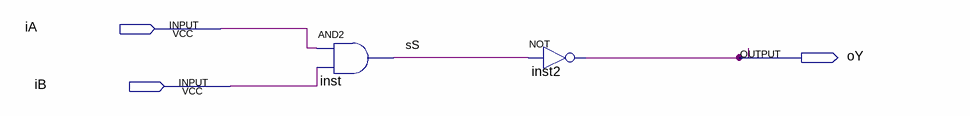
[diagram p0: schematic sheet]
// Quartus schematic MyFirstDigitalSystem.bdf as structural Verilog: 2 symbols, 3 pins
module MyFirstDigitalSystem (
  input  iA,
  input  iB,
  output oY
);

  wire sS;

  and inst (sS, iA, iB);
  not inst2 (oY, sS);
endmodule
